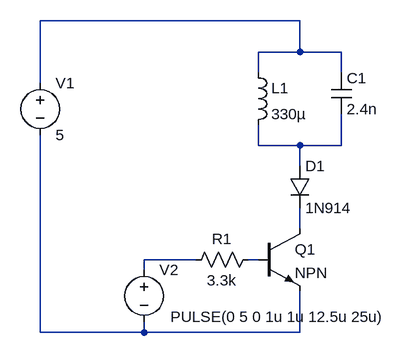
[diagram p0: schematic ultrasonic.asc]
ultrasonic.asc, the LTspice schematic file:
Version 4
SHEET 1 880 680
WIRE 224 64 -176 64
WIRE 224 112 224 64
WIRE 224 112 160 112
WIRE 288 112 224 112
WIRE 160 144 160 112
WIRE 288 144 288 112
WIRE -176 160 -176 64
WIRE 160 256 160 224
WIRE 224 256 160 256
WIRE 288 256 288 208
WIRE 288 256 224 256
WIRE 224 288 224 256
WIRE 224 384 224 352
WIRE 64 432 -16 432
WIRE 160 432 144 432
WIRE -16 448 -16 432
WIRE -176 544 -176 240
WIRE -16 544 -16 528
WIRE -16 544 -176 544
WIRE 224 544 224 480
WIRE 224 544 -16 544
SYMBOL cap 272 144 R0
SYMATTR InstName C1
SYMATTR Value 2.4n
SYMBOL ind 144 128 R0
SYMATTR InstName L1
SYMATTR Value 330µ
SYMBOL voltage -176 144 R0
WINDOW 123 0 0 Left 0
WINDOW 39 0 0 Left 0
SYMATTR InstName V1
SYMATTR Value 5
SYMBOL voltage -16 432 R0
WINDOW 3 41 88 Left 0
WINDOW 123 0 0 Left 0
WINDOW 39 0 0 Left 0
SYMATTR InstName V2
SYMATTR Value PULSE(0 5 0 1u 1u 12.5u 25u)
SYMBOL npn 160 384 R0
SYMATTR InstName Q1
SYMBOL diode 208 288 R0
SYMATTR InstName D1
SYMATTR Value 1N914
SYMBOL res 160 416 R90
WINDOW 0 0 56 VBottom 0
WINDOW 3 32 56 VTop 0
SYMATTR InstName R1
SYMATTR Value 3.3k

The netlist it stands for:
* ultrasonic.asc
C1 N001 N002 2.4n
L1 N001 N002 330µ
V1 N001 N006 5
V2 N004 N006 PULSE(0 5 0 1u 1u 12.5u 25u)
Q1 N003 N005 N006 0 NPN
D1 N002 N003 1N914
R1 N005 N004 3.3k
.model D D
.lib standard.dio
.model NPN NPN
.model PNP PNP
.lib standard.bjt
.backanno
.end